# Altium schematic sheet External_Camera_HAT_Regulators.SchDoc: Regulators
size B; Date: 1/16/2024; Author: Robert Pafford; Organization: ORGANIZATION; Address1: ADDRESS 1; Address2: ADDRESS 2; Address3: ADDRESS 3; Address4: ADDRESS 4; Revision: -; SheetNumber: 2; SheetTotal: 4; ENG_APP_DATE: --/--/--; DSN_APP_DATE: --/--/--; CHK_APP_DATE: --/--/--
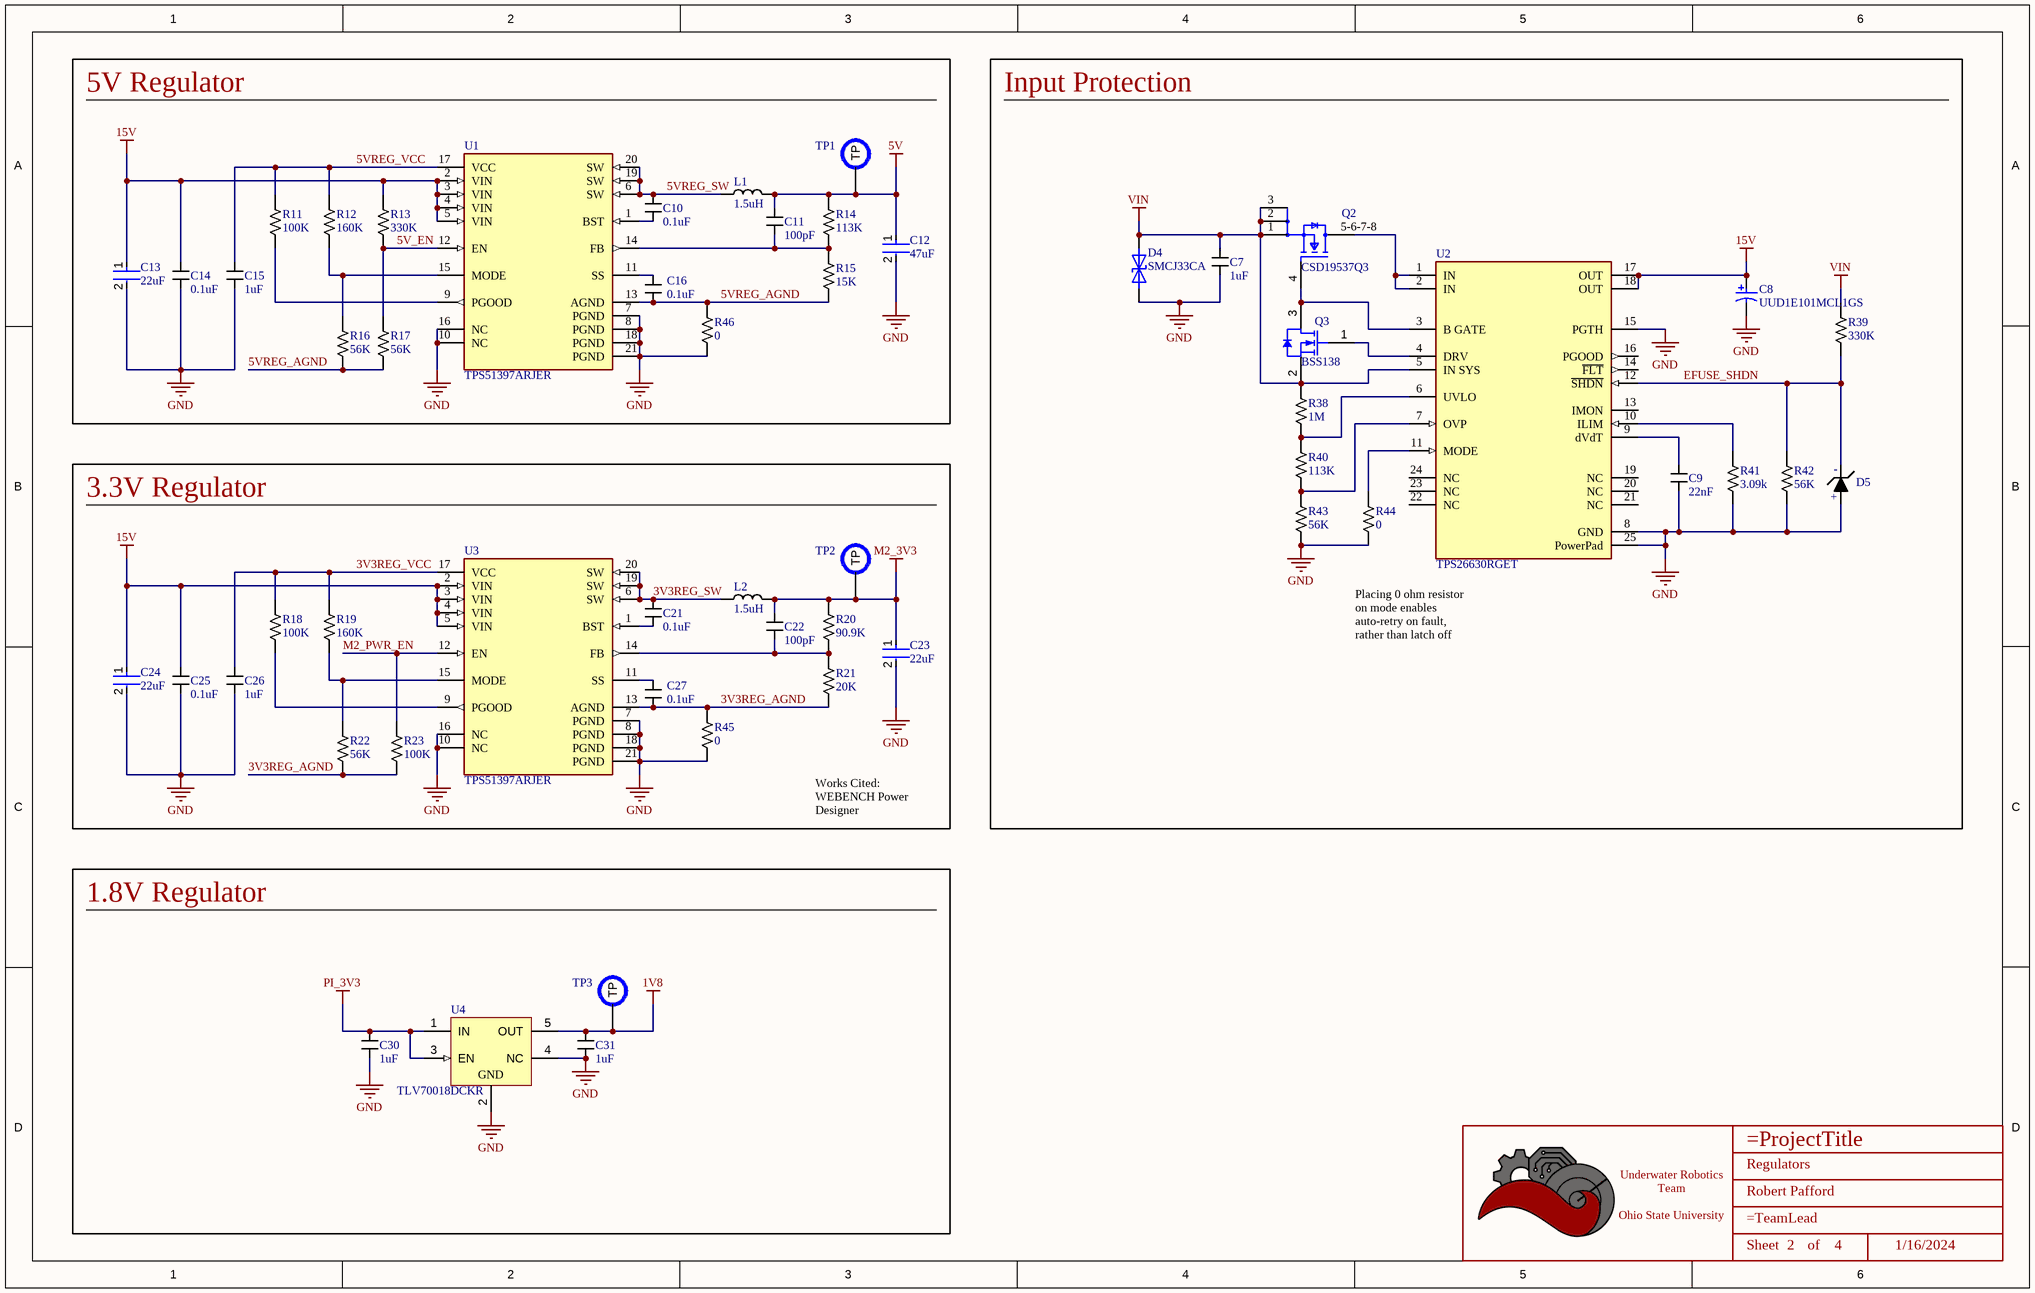
[diagram p0: External_Camera_HAT_Regulators.SchDoc]

## Parts
*  Title_Block  [LOGO]  (value not drawn)  (graphical)
C7  value 1uF  [CAPACITOR_0603]  (hidden comment: 1uF Ceramic 25V)
C8  UUD1E101MCL1GS  [NIC-CAPA2-6.3X7.7_V]
C9  value 22nF  [CAPACITOR_0402]  (hidden comment: 22nF Ceramic 25V)
C10  value 0.1uF  [CAPACITOR_0402]  (hidden comment: 100nF Ceramic 25V)
C11  value 100pF  [CAPACITOR_0402]  (hidden comment: 100pF Ceramic 25V)
C12  Capacitance: 47uF  [FP-GRM31C-0_2-e0_3_0_8-MFG]  (hidden comment: GRM31CR61A476KE15L)
C13  Capacitance: 22uF  [FP-C2012-125-0_2-MFG]  (hidden comment: C2012X5R1V226M125AC)
C14  value 0.1uF  [CAPACITOR_0402]  (hidden comment: 100nF Ceramic 25V)
C15  value 1uF  [CAPACITOR_0402]  (hidden comment: 1uF Ceramic 16V)
C16  value 0.1uF  [CAPACITOR_0402]  (hidden comment: 100nF Ceramic 25V)
C21  value 0.1uF  [CAPACITOR_0402]  (hidden comment: 100nF Ceramic 25V)
C22  value 100pF  [CAPACITOR_0402]  (hidden comment: 100pF Ceramic 25V)
C23  Capacitance: 22uF  [FP-C2012-125-0_2-MFG]  (hidden comment: C2012X5R1V226M125AC)
C24  Capacitance: 22uF  [FP-C2012-125-0_2-MFG]  (hidden comment: C2012X5R1V226M125AC)
C25  value 0.1uF  [CAPACITOR_0402]  (hidden comment: 100nF Ceramic 25V)
C26  value 1uF  [CAPACITOR_0402]  (hidden comment: 1uF Ceramic 16V)
C27  value 0.1uF  [CAPACITOR_0402]  (hidden comment: 100nF Ceramic 25V)
C30  value 1uF  [CAPACITOR_0402]  (hidden comment: 1uF Ceramic 16V)
C31  value 1uF  [CAPACITOR_0402]  (hidden comment: 1uF Ceramic 16V)
D4  SMCJ33CA  [DIOM7959X262N]
D5  Zener_Diode_3.3V_250mW_1  [SOD-123]  (value not drawn)
L1  value 1.5uH  [IHLP2525EZ]  (hidden comment: 1.5uH Shielded)
L2  value 1.5uH  [IHLP2525EZ]  (hidden comment: 1.5uH Shielded)
Q2  CSD19537Q3  [FP-DQG0008A-MFG]
Q3  BSS138  [FAIR-SOT23-3_V]
R11  Value  (Ohms): 100K  [RESISTOR_0402]  (hidden comment: 100k Ohm 1% 1/16W)
R12  Value  (Ohms): 160K  [RESISTOR_0402]  (hidden comment: 160k Ohm 1% 1/16W)
R13  Value  (Ohms): 330K  [RESISTOR_0402]  (hidden comment: 330k Ohm 1% 1/16W)
R14  Value  (Ohms): 113K  [RESISTOR_0402]  (hidden comment: 113k Ohm 1% 1/16W)
R15  Value  (Ohms): 15K  [RESISTOR_0402]  (hidden comment: 15k Ohm 1% 1/16W)
R16  Value  (Ohms): 56K  [RESISTOR_0402]  (hidden comment: 56k Ohm 1% 1/16W)
R17  Value  (Ohms): 56K  [RESISTOR_0402]  (hidden comment: 56k Ohm 1% 1/16W)
R18  Value  (Ohms): 100K  [RESISTOR_0402]  (hidden comment: 100k Ohm 1% 1/16W)
R19  Value  (Ohms): 160K  [RESISTOR_0402]  (hidden comment: 160k Ohm 1% 1/16W)
R20  Value  (Ohms): 90.9K  [RESISTOR_0402]  (hidden comment: 90.9k Ohm 1% 1/16W)
R21  Value  (Ohms): 20K  [RESISTOR_0402]  (hidden comment: 20k Ohm 1% 1/16W)
R22  Value  (Ohms): 56K  [RESISTOR_0402]  (hidden comment: 56k Ohm 1% 1/16W)
R23  Value  (Ohms): 100K  [RESISTOR_0402]  (hidden comment: 100k Ohm 1% 1/16W)
R38  Value  (Ohms): 1M  [RESISTOR_0402]  (hidden comment: 1M Ohm 1% 1/16W)
R39  Value  (Ohms): 330K  [RESISTOR_0402]  (hidden comment: 330k Ohm 1% 1/16W)
R40  Value  (Ohms): 113K  [RESISTOR_0402]  (hidden comment: 113k Ohm 1% 1/16W)
R41  Value  (Ohms): 3.09k  [RESISTOR_0402]  (hidden comment: 3.09k Ohm 1% 1/16W)
R42  Value  (Ohms): 56K  [RESISTOR_0402]  (hidden comment: 56k Ohm 1% 1/16W)
R43  Value  (Ohms): 56K  [RESISTOR_0402]  (hidden comment: 56k Ohm 1% 1/16W)
R44  Value  (Ohms): 0  [RESISTOR_0402]  (hidden comment: 0 Ohm 1% 1/16W)
R45  Value  (Ohms): 0  [RESISTOR_0402]  (hidden comment: 0 Ohm 1% 1/16W)
R46  Value  (Ohms): 0  [RESISTOR_0402]  (hidden comment: 0 Ohm 1% 1/16W)
TP1  PCB Test Point  [TESTPOINT_1.2MM]  (value not drawn)  (no BOM)
TP2  PCB Test Point  [TESTPOINT_1.2MM]  (value not drawn)  (no BOM)
TP3  PCB Test Point  [TESTPOINT_1.2MM]  (value not drawn)  (no BOM)
U1  TPS51397ARJER  [FP-RJE0020B-MFG]
U2  TPS26630RGET  [FP-RGE0024H-MFG]
U3  TPS51397ARJER  [FP-RJE0020B-MFG]
U4  TLV70018DCKR  [DCK0005A_N]

## Blocks framed on the sheet
5V Regulator: C10-C16 L1 R11-R17 R46 TP1 U1
Input Protection: C7-C9 D4 D5 Q2 Q3 R38-R44 U2
3.3V Regulator: C21-C27 L2 R18-R23 R45 TP2 U3
1.8V Regulator: C30 C31 TP3 U4

## Nets
1V8: C31.1 TP3.TP U4.5(OUT)
5V: C11.1 C12.1 L1.1 R14.1 TP1.TP
15V: C8.1 C13.1 C14.1 C24.1 C25.1 R13.1 U1.2(VIN) U1.3(VIN) U1.4(VIN) U1.5(VIN) U2.17(OUT) U2.18(OUT) U3.2(VIN) U3.3(VIN) U3.4(VIN) U3.5(VIN)
GND: C7.2 C8.2 C9.2 C12.2 C13.2 C14.2 C15.2 C23.2 C24.2 C25.2 C26.2 C30.2 C31.2 D4.1 D5.1 R41.2 R42.2 R43.2 R44.2 R45.2 R46.2 U1.7(PGND) U1.8(PGND) U1.10(NC) U1.16(NC) U1.18(PGND) U1.21(PGND) U2.8(GND) U2.15(PGTH) U2.25(PowerPad) U3.7(PGND) U3.8(PGND) U3.10(NC) U3.16(NC) U3.18(PGND) U3.21(PGND) U4.2(GND) U4.4(NC)
M2_3V3: C22.1 C23.1 L2.1 R20.1 TP2.TP
PI_3V3: C30.1 U4.1(IN) U4.3(EN)
VIN: C7.1 D4.2 Q2.1(S) Q2.2(S) Q2.3(S) Q3.2(S) R38.1 R39.1 U2.5(IN_SYS)
3V3REG_AGND: C27.2 R21.2 R22.2 R23.2 R45.1 U3.13(AGND)
3V3REG_SW: C21.1 L2.2 U3.6(SW) U3.19(SW) U3.20(SW)
3V3REG_VCC: C26.1 R18.1 R19.1 U3.17(VCC)
5V_EN: R13.2 R17.1 U1.12(EN)
5VREG_AGND: C16.2 R15.2 R16.2 R17.2 R46.1 U1.13(AGND)
5VREG_SW: C10.1 L1.2 U1.6(SW) U1.19(SW) U1.20(SW)
5VREG_VCC: C15.1 R11.1 R12.1 U1.17(VCC)
EFUSE_SHDN: D5.2 R39.2 R42.1 U2.12(~{SHDN})
M2_PWR_EN: R23.1 U3.12(EN)
NetC9_1: C9.1 U2.9(dVdT)
NetC10_2: C10.2 U1.1(BST)
NetC11_2: C11.2 R14.2 R15.1 U1.14(FB)
NetC16_1: C16.1 U1.11(SS)
NetC21_2: C21.2 U3.1(BST)
NetC22_2: C22.2 R20.2 R21.1 U3.14(FB)
NetC27_1: C27.1 U3.11(SS)
NetQ2_4: Q2.4(G) Q3.3(D) U2.3(B_GATE)
NetQ2_5-6-7-8: Q2.5-6-7-8(D) U2.1(IN) U2.2(IN)
NetQ3_1: Q3.1(G) U2.4(DRV)
NetR11_2: R11.2 U1.9(PGOOD)
NetR12_2: R12.2 R16.1 U1.15(MODE)
NetR18_2: R18.2 U3.9(PGOOD)
NetR19_2: R19.2 R22.1 U3.15(MODE)
NetR38_2: R38.2 R40.1 U2.6(UVLO)
NetR40_2: R40.2 R43.1 U2.7(OVP)
NetR41_1: R41.1 U2.10(ILIM)
NetR44_1: R44.1 U2.11(MODE)

Not connected (* = marked no-connect by the designer): U2 13(IMON) 14(~{FLT}) 16(PGOOD) 19(NC) 20(NC) 21(NC) 22(NC) 23(NC) 24(NC)

## Notes on the sheet
- Placing 0 ohm resistor on mode enables auto-retry on fault, rather than latch off
- Works Cited:
  WEBENCH Power Designer
- DWG. NO.
- REV.
- SHT.
- THIS DOCUMENT AND THE DATA DISCLOSED HEREIN OR HEREWITH IS THE PROPERTY OF ALTIUM LIMITED AND MAY BE FREELY DISTRIBUTED IN WHOLE. NO RIGHTS ARE RESERVED OR EXPRESS OR IMPLIED WARANTEE GIVEN.
- REVISION
- DESCRIPTION
- DATE
- APPROVED
- ENG:
- APPROVALS
- PROJECT
- DSN:
- CHK:
- REFERENCE DOCUMENTS
- PROJECT REVISION:
- TITLE
- DOCUMENT REVISION:
- DESIGN ITEM:
- BOM:
- FAB DWG:
- PCB DWG:
- ASSY DWG:
- SCALE:
- SIZE
- B
- CAGE CODE
- FILE NAME
- DWG NO.
- SHEET
- OF
- REV
- (in symbol Title_Block) Underwater Robotics Team / Ohio State University; Sheet; of
- (in symbol Zener_Diode_3.3V_250mW_1) -; +

## Library data of the parts
* = Title_Block: UWRT Schematic Title Block Template / Created June 2021, Dylan Trainor
C7 = CAPACITOR_1uF_0603_25V: Cap 1uF 25V +/-10% / Ceramic 0603; Voltage: 16V; Made By: Flip B; Tolerance: +/- 10%; Supplier 1: Digikey; Supplier Part Number 1: 1276-1102-1-ND
C8 = CMP-0687-00063-1: Aluminum Electrolytic Capacitor, UD Series, Low Impedance, 100 uF, 25 V, + / - 20%, -55 to 105 degC, Chip Type, 6.3 x 7.7 mm D x L, Pb-Free, Reel; Manufacturer: Nichicon; Rated Ripple Current (at 100kHz): 280 mA; Endurance Time: 2000 h; Rated Voltage: 25 V; Packing: Dia382mm Reel; Tolerance Rated Capacitance: -20 to 20%; Impedance: 0.34 Ohm; Rated Capacitance: 100 uF; PackageReference: CAPAE-D6.3H7.7; RoHS: TRUE; PackageDescription: 2-Pin Surface Mount Device, Diameter 6.3 mm, Height 7.7 mm, Pitch 5.4 mm; Mounting Technology: Surface Mount; ComponentLink3Description: Package Specification; Diameter: 6.3 mm; DatasheetVersion: 08/2012; PartNumber: UUD1E101MCL1GS; ComponentLink3URL: http://products.nichicon.co.jp/en/pdf/XJA043/e-ud.pdf; Length: 7.7 mm; ComponentLink2Description: Datasheet; ComponentLink2URL: http://products.nichicon.co.jp/en/pdf/XJA043/e-ud.pdf; ComponentLink1Description: Manufacturer URL; ComponentLink1URL: http://www.nichicon.co.jp/
C9 = CAPACITOR_0.022uF_0402: Cap 22nF 25V +/-10% / Ceramic 0402; Made By: Robert Pafford; Tolerance: +/- 10%; Voltage: 25V; Supplier 1: Digi-Key; Supplier Part Number 1: 445-1261-1-ND
C10 C14 C16 C21 C25 C27 = CAPACITOR_0.1uF_0402: Cap 100nF 25V +/-10% / Ceramic 0402; Made By: Robert Pafford; Tolerance: +/- 10%; Voltage: 25V; Supplier 1: Digi-Key; Supplier Part Number 1: 478-7868-1-ND
C11 C22 = CAPACITOR_0.0001uF_0402: Cap 100pF 25V +/-10% / Ceramic 0402; Made By: Robert Pafford; Tolerance: +/- 10%; Voltage: 25V; Supplier 1: Digikey; Supplier Part Number 1: 399-C0402C101K3GAC7867CT-ND
C12 = CMP-06035-015661-1: Chip Multilayer Ceramic Capacitors for General Purpose, 1206, 47uF, X5R, 15%, 10%, 10V; Case/Package: 1206; Min Operating Temperature: -55°C; REACH SVHC: No SVHC; Mount: Surface Mount; Height: 1.6mm; Thickness: 0.071inch; Packaging: Tape and Reel; Tolerance: 10%; Dielectric: X5R; Case Code (Imperial): 1206; Lead Free: Lead Free; Width: 1.6mm; Voltage Rating (DC): 10V; Material: Ceramic; Max Operating Temperature: 85°C; Voltage: 10V; Package Quantity: 2000; Case Code (Metric): 3216; Termination: SMD/SMT; Voltage Rating: 10V; Depth: 1.6mm; Length: 3.2mm
C13 C23 C24 = CMP-2000-06038-3: Multilayer Ceramic Capacitors 22μF ±20% 35V X5R SMD 0805; Tolerance: 20%; RoHS Compliant: Yes; Height: 1.25mm; Termination: SMD/SMT; Case/Package: 0805; Thickness: 0.057inch; Max Operating Temperature: 85°C; Min Operating Temperature: -55°C; Voltage Rating (DC): 35V; Length: 0.079inch; Dielectric: X5R; Dielectric Material: Ceramic; Voltage Rating: 35V; Mount: Surface Mount; Package Quantity: 2000; Lead Free: Lead Free; Weight: 0.000194oz; REACH SVHC: No SVHC; Width: 0.049inch; Packaging: Tape and Reel; Series: C; Case Code (Metric): 2012; Case Code (Imperial): 0805
C15 C26 C30 C31 = CAPACITOR_1uF_0402: Cap 1uF 16V +/-10% / Ceramic 0402; Made By: Robert Pafford; Tolerance: +/- 10%; Voltage: 16V; Supplier 1: Digi-Key; Supplier Part Number 1: 478-0402YD105KAT4ADKR-ND
D4 = SMCJ33CA: 53.3V Clamp 28.1A Ipp Tvs Diode Surface Mount SMC (DO-214AB); MF: Bourns Inc.; Price: None; SnapEDA_Link: https://www.snapeda.com/parts/SMCJ33CA/Bourns/view-part/4833712/?ref=snap; Arrow_Electronics-Purchase-URL: https://snapeda.com/shop?store=Arrow+Electronics&id=4833712; Availability: Good; Mouser-Purchase-URL: https://snapeda.com/shop?store=Mouser&id=4833712; MP: SMCJ33CA; Value: *; DigiKey-Purchase-URL: https://snapeda.com/shop?store=DigiKey&id=4833712; Package: None; Supplier 1: Digikey; Supplier Part Number 1: SMCJ33CABCT-ND
D5 = Zener_Diode_3.3V_250mW_1: Zener Diode | 3.3 V | 250 mW | SOT-23; Made By: Nathan A; Voltage - Zener: 10V; Power: 410mW; Package: SOD-123; ComponentLink1Description: Datasheet; ComponentLink1URL: https://www.panjit.com.tw/upload/datasheet/BZT52-C2V4_SERIES.pdf; Supplier 1: Digikey; Supplier Part Number 1: MMSZ4684T1GOSCT-ND
L1 L2 = INDUCTOR_1.5uH_IHLP2525EZ_1: Inductor Shielded 1.5uH 12A +/-20%; Made By: Robert Pafford; DC Resistance: 9mOhm; Tolerance: +/- 20%; Current Rating: 12A; Supplier 1: Digikey; Supplier Part Number 1: 541-4344-1-ND
Q2 = CMP-04962-000024-1: MOSFET N-CH 100V 50A 8VSON; Max Power Dissipation: 2.8W; Turn-On Delay Time: 5ns; Gate to Source Voltage (Vgs): 20V; Input Capacitance: 1.68nF; Rds On Max: 14.5mR; Fall Time: 3ns; Turn-Off Delay Time: 10ns; Continuous Drain Current (ID): 50A; Lead Free: Contains Lead; Mount: Surface Mount; Number of Pins: 8; Min Operating Temperature: -55°C; Packaging: Rail/Tube; Rise Time: 3ns; Contact Plating: Copper; RoHS Compliant: Yes; Drain to Source Voltage (Vdss): 100V; Max Operating Temperature: 150°C
Q3 = CMP-013-00021-4: N-Channel Logic Level Enhancement Mode Field Effect Transistor, 220 mA, 50 V, -55 to 150 degC, 3-Pin SOT-23, RoHS, Tape and Reel; Manufacturer: Fairchild; Elements: 1; Nominal Vgs: 1.3V; Resistance: 0.7Ohm; Typical Rise Time: 9ns; Rds On Max: 3.5Ohm; Nominal Dual Supply Voltage: 50V; Input Capacitance: 27pF; Package Version: Rev. 12, 03/2016; Power: 360mW; Packaging: TapeandReel; Package Description: 3-Pin Small Outline Transistor, Body 2.92 x 1.325 mm, Pitch 0.95 mm; Datasheet URL: https://www.fairchildsemi.com/datasheets/BS/BSS138.pdf; Min Operating Temperature: -55°C; Pins: 3; RoHS Compliant: True; Package Reference: SOT23-3; Package Quantity: 1; Case/Package: TO-236-3; Mounting Technology: SM; Max Operating Temperature: 150°C; Datasheet Version: Rev. C, 10/2005
R11 R18 R23 = RESISTOR_100K_0402: RES 100k OHM 1% 1/16W 0402; Tolerance: +/- 1%; Made By: Robert Pafford; Wattage: 1/16W; Supplier 1: Digikey; Supplier Part Number 1: YAG3434CT-ND
R12 R19 = RESISTOR_160K_0402: RES 160k OHM 1% 1/16W 0402; Tolerance: +/- 1%; Made By: Robert Pafford; Wattage: 1/16W; Supplier 1: Digikey; Supplier Part Number 1: YAG2996CT-ND
R13 R39 = RESISTOR_330K_0402: RES 330k OHM 1% 1/16W 0402; Tolerance: +/- 1%; Made By: Robert Pafford; Wattage: 1/16W; Supplier 1: Digikey; Supplier Part Number 1: 311-330KLRCT-ND
R14 R40 = RESISTOR_113K_0402: RES 113k OHM 1% 1/16W 0402; Tolerance: +/- 1%; Made By: Robert Pafford; Wattage: 1/16W; Supplier 1: Digikey; Supplier Part Number 1: YAG2368CT-ND
R15 = RESISTOR_15K_0402: RES 15k OHM 1% 1/16W 0402; Tolerance: +/- 1%; Made By: Robert Pafford; Wattage: 1/16W; Supplier 1: Digikey; Supplier Part Number 1: 311-15.0KLRCT-ND
R16 R17 R22 R42 R43 = RESISTOR_56K_0402: RES 56k OHM 1% 1/16W 0402; Tolerance: +/- 1%; Made By: Robert Pafford; Wattage: 1/16W; Supplier 1: Digi-Key; Supplier Part Number 1: YAG3501CT-ND
R20 = RESISTOR_90.9K_0402: RES 90.9k OHM 1% 1/16W 0402; Tolerance: +/- 1%; Made By: Robert Pafford; Wattage: 1/16W; Supplier 1: Digikey; Supplier Part Number 1: YAG5314CT-ND
R21 = RESISTOR_20K_0402: RES 20k OHM 1% 1/16W 0402; Tolerance: +/- 1%; Made By: Robert Pafford; Wattage: 1/16W; Supplier 1: Digikey; Supplier Part Number 1: YAG3454CT-ND
R38 = RESISTOR_1M_0402: RES 1M OHM 1% 1/16W 0402; Tolerance: +/- 1%; Made By: Robert Pafford; Wattage: 1/16W; Supplier 1: Digikey; Supplier Part Number 1: YAG3450CT-ND
R41 = RESISTOR_3.09K_0402: RES 3.09k OHM 1% 1/16W 0402; Tolerance: +/- 1%; Made By: Robert Pafford; Wattage: 1/16W; Supplier 1: Digikey; Supplier Part Number 1: 13-AC0402FR-073K09LCT-ND
R44-R46 = RESISTOR_0_0402: RES 0 OHM 1% 1/16W 0402; Tolerance: +/- 1%; Made By: Robert Pafford; Wattage: 1/16W; Supplier 1: Digikey; Supplier Part Number 1: 13-AC0402FR-070RLCT-ND
TP1-TP3 = TESTPOINT: Made By: Robert Pafford
U1 U3 = CMP-04918-000702-1: 10-A SYNCHRONOUS STEP-DOWN REGUL
U2 = CMP-04910-000050-1: POWER MANAGEMENT; RoHS Compliant: Yes
U4 = CMP-0394-00928-2: Single Output LDO, 200 mA, Fixed 1.8 V Output, 2 to 5.5 V Input, with Low IQ, 5-pin SC70 (DCK), -40 to 125 degC, Green (RoHS & no Sb/Br); Manufacturer: Texas Instruments; Vout Adj(Max)(V): 1.8; Vin(Max)(V): 5.5; SubFamily: Single Channel LDO; Iout(Max)(A): 0.2; Iq(Typ)(mA): 0.03; Accuracy(%): 2; Vdo(Typ)(mV): 175; PartNumber: TLV70018DCKR; ComponentLink3URL: http://www.ti.com/litv/pdf/mpds025f; ComponentLink1URL: http://www.ti.com/; PackageDescription: 5-Pin Plastic Small-Outline, Body 2 x 1.25 mm, Pitch 0.65 mm; DatasheetVersion: SLVSA00D; Eco-Plan: Green (RoHS & no Sb/Br); Mounting Technology: Surface Mount; ComponentLink2URL: http://www.ti.com/general/docs/lit/getliterature.tsp?genericPartNumber=TLV70018&fileType=pdf; ComponentLink3Description: Package Specification; Vout Adj(Min)(V): 1.8; ComponentLink1Description: Manufacturer URL; Code_JEDEC: MO-203; PackageReference: DCK0005A; ComponentLink2Description: Datasheet; Vin(Min)(V): 2; PackageVersion: 4093553-3/G; Fixed Output Options(V): 1.8